# EAGLE design BUZZI-21 (EAGLE 5.06)
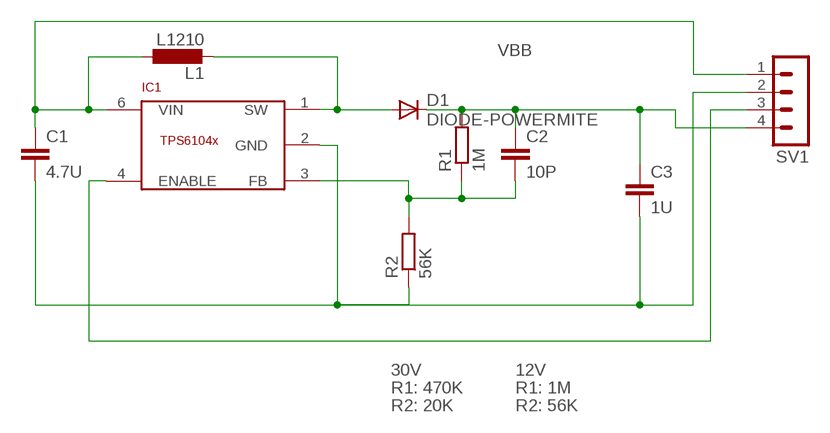
[diagram p0: schematic, sheet 1]

## Parts
C1  4.7U  C-EUC1210  [C1210]
C2  10P  C-EUC0805K  [C0805K]
C3  1U  C-EUC1210  [C1210]
D1  DIODE-POWERMITE  [POWERMITE]
IC1  TPS6104X  [SOT23-6L]
L1  L1210  [C1210]
R1  1M  R-EU_R0805  [R0805]
R2  56K  R-EU_R0805  [R0805]
SV1  MA04-1  [MA04-1]

## Nets
GND: C1.2 C3.2 IC1.2(GND) R2.1 SV1.2
N$1: IC1.4(ENABLE) SV1.3
N$17: D1.P$2(A) IC1.1(SW) L1.2
N$20: C2.2 IC1.3(FB) R1.1 R2.2
VBB: C2.1 C3.1 D1.P$1(C) R1.2 SV1.4
VCC: C1.1 IC1.6(VIN) L1.1 SV1.1

## Notes on the sheet
- 30V | 12V
- R1: 470K | R1: 1M
- R2: 20K | R2: 56K

## Library data of the parts
C1 C3 = turbod3:C-EU: CAPACITOR, European symbol
C2 = rcl:C-EU: CAPACITOR, European symbol
D1 = turbod3:DIODE-POWERMITE
IC1 = turbod3:TPS6104X
L1 = turbod3:L
R1 R2 = rcl:R-EU_: RESISTOR, European symbol
SV1 = con-lstb:MA04-1: PIN HEADER

## Net classes
0 default: width 0.5 mm

## Board
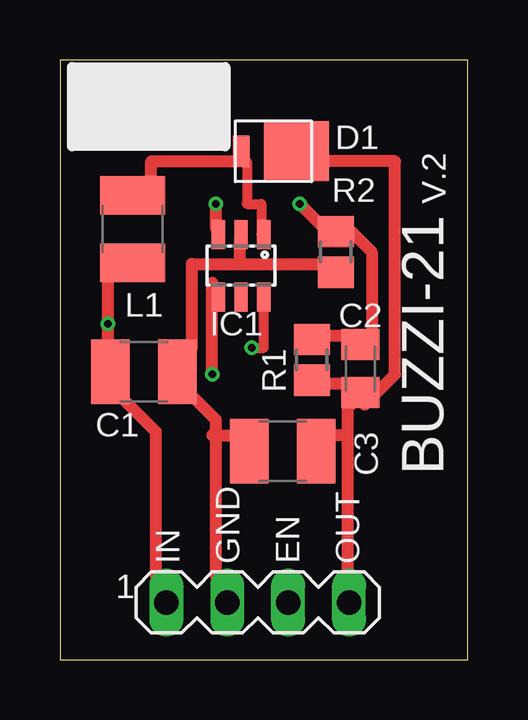
[diagram p1: board, top side]
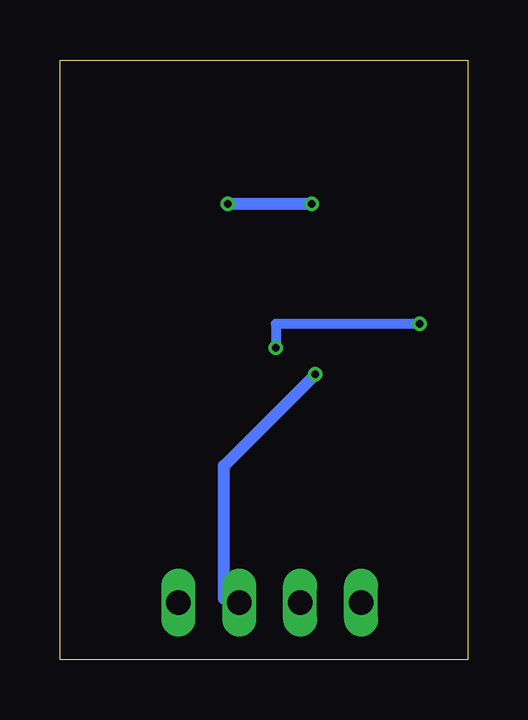
[diagram p2: board, bottom side, seen from below]

Size 17 x 25 mm. Coordinates in mm from the lower left corner, seen from the top.
Outline: 0,0 17,0 17,25 0,25 0,0
Copper layers (1*16): Top 0.035mm / dielectric 1.5mm / Bottom 0.035mm
Design rules "PCB-POOL": minimum track width 6mil, minimum drill 12mil, track to track 6mil, track to pad 6mil, pad to pad 6mil, via to via 6mil, smd to smd 6mil, copper to edge 20mil, drill to drill 8mil, minimum pad ring 8mil, minimum via ring 6mil, stop-mask expansion 3mil, vias tented up to drill 0mil, thermal gap 8mil

### Footprints (pad centres in the part's own frame; a part is rotated, then mirrored left to right if it is on the bottom)
C1210 = smd 1.6 x 2.7: 1 -1.4,0; 2 1.4,0
C0805K = smd 1.3 x 1.6: 1 -1,0; 2 1,0
POWERMITE = smd 2.7 x 2.5: P$1 0,0 | smd 0.7 x 1.3: P$2 2.3,0
SOT23-6L = smd 0.55 x 1.2: 1 -0.95,-1.3; 2 0,-1.3; 3 0.95,-1.3; 4 0.95,1.3; 5 0,1.3; 6 -0.95,1.3
R0805 = smd 1.3 x 1.5: 1 -0.85,0; 2 0.85,0
MA04-1 = drill 1.016 long: 1 -3.81,0; 2 -1.27,0; 3 1.27,0; 4 3.81,0

### Placement (x,y rotation side)
C1  3.5,12 0 top
C2  12.53,12.13 90 top
C3  9.29,8.69 180 top
D1  9.86,21.19 180 top
IC1  7.55,16.42 180 top
L1  3.03,17.95 90 top
R1  10.5,12.5 270 top
R2  11.5,17 90 top
SV1  8.25,2.38 0 top

### Tracks (layer width: path | path; a pad name or v marks a point on that pad's centre or on a via)
GND
  Top 0.5: 7.5,16.5 7.5,17.5 IC1.2 | 7.5,16.5 11,16.5 R2.1 | 6.5,9.35 6.5,3.5 SV1.2 | 6.5,9.35 6.5,10 5.5,11 C1.2 5.5,13 5.5,16.5 7.5,16.5 | 6.5,9.35 7.62,9.35 C3.2 | 6.5,9.35 6.35,9.35
N$1  (via drill 0.3)
  Top 0.5: v6.35,11.89 6.35,15.7 IC1.4
  Bottom 0.5: v6.35,11.89 10.16,8.08 10.16,2.54 SV1.3
N$17
  Top 0.406: 7.62,20.78 7.8,20.78 7.8,19 8.4,19 8.4,17.72 IC1.1
  Top 0.5: D1.P$2 7.62,20.78 3.81,20.78 3.81,19.51 L1.2
N$20  (via drill 0.3)
  Top 0.5: R1.1 11,13.5 12,13.5 C2.2 13,13.5 13,17 12,18 R2.2 11,18 v10,19 | v6.5,19 6.5,18 IC1.3
  Bottom 0.5: v6.5,19 v10,19
VBB
  Top 0.5: R1.2 11,11.5 12,11.5 C2.1 | 12,9.35 12,3.5 SV1.4 | 12,9.35 12,10.5 C2.1 | D1.P$1 10.16,20.78 13.97,20.78 13.97,11.89 12.7,10.62 C2.1 | C3.1 11.43,9.35 12,9.35
VCC  (via drill 0.3)
  Top 0.406: L1.1 2,16.55 v2,14 | v8,13 8.5,13 IC1.6
  Top 0.5: L1.1 2,16 v2,14 2,13 C1.1 2.5,11 4,9.5 4,3.5 SV1.1
  Bottom 0.406: v2,14 8,14 v8,13

### Text on the board
tNames: V.2 | BUZZI-21 | IN | GND | EN | OUT